# Altium schematic sheet PowerFilters.SchDoc
size A; SheetNumber: 14; SheetTotal: 14
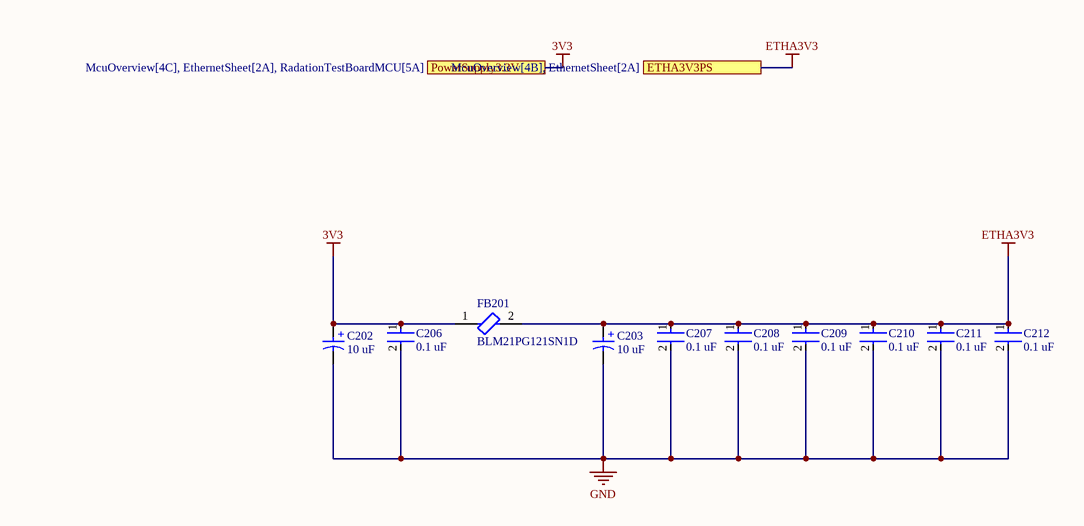
[diagram p0: PowerFilters.SchDoc]

## Parts
C202  10 uF  [WCAP-HTG5_D6.3H8]
C203  10 uF  [WCAP-HTG5_D6.3H8]
C206  0.1 uF  [FP-CC0603-DA-IPC_A]
C207  0.1 uF  [FP-CC0603-DA-IPC_A]
C208  0.1 uF  [FP-CC0603-DA-IPC_A]
C209  0.1 uF  [FP-CC0603-DA-IPC_A]
C210  0.1 uF  [FP-CC0603-DA-IPC_A]
C211  0.1 uF  [FP-CC0603-DA-IPC_A]
C212  0.1 uF  [FP-CC0603-DA-IPC_A]
FB201  BLM21PG121SN1D  [FP-BLM21-0_2-t0_85-e0_5-d-IPC_C]

## Ports
ETHA3V3PS (see McuOverview[4B], EthernetSheet[2A]), PowerSupply3.3V (see McuOverview[4C], EthernetSheet[2A], RadationTestBoardMCU[5A])

## Nets
3V3: C202.1(P) C206.1 FB201.1 ; port PowerSupply3.3V
ETHA3V3: C203.1(P) C207.1 C208.1 C209.1 C210.1 C211.1 C212.1 FB201.2 ; port ETHA3V3PS
GND: C202.2(N) C203.2(N) C206.2 C207.2 C208.2 C209.2 C210.2 C211.2 C212.2

## Notes on the sheet
- (in symbol CMP-03913-134709123-1) +

## Library data of the parts
C202 C203 = CMP-03913-134709123-1: 870575873001 Cap, 10Uf, 63V, Alu Elec, Hybrid, Rad Rohs Compliant: Yes 870575873001; Capacitance: 10µF; Pitch: 2.5mm; Hole Diameter: 900µm; ESR (Equivalent Series Resistance): 100mΩ; Leakage Current: 6.3µA; Ripple Current: 1.06A; NexarPartId: 134709123; Diameter: 6.3mm; Length: 8mm; Voltage Rating: 63V; Max Operating Temperature: 105°C; Min Operating Temperature: -55°C; RoHS: Compliant
C206-C212 = CMP-03422-001490-1: CAP CER 0.1UF 50V X7R 0603 CC0603JRX7R9BB104; Capacitance: 100nF; Tolerance: 5%; Number of Pins: 2; Depth: 0.8mm; Weight: 7.1E-05oz; Radiation Hardening: No; Case Code (Metric): 1608; Dielectric: X7R; Max Operating Temperature: 125°C; Voltage Rating (DC): 50V; Case/Package: 0603; Halogen Free: Halogen Free; Mount: Surface Mount; Lead Free: Lead Free; Termination: SMD/SMT; RoHS Compliant: Yes; Length: 1.6mm; Series: CC; Resistor Type: Ceramic; Case Code (Imperial): 0603; Construction: Flat; Width: 0.031inch; Height: 0.8mm; Voltage Rating: 50V; Min Operating Temperature: -55°C; Thickness: 0.035inch; Packaging: Tape and Reel
FB201 = CMP-0686-00612-3: Chip Ferrite Bead, 0805, 120Ω @ 100MHz, 0.03Ω, 25%, 3A; Impedance: 120R; Number of Circuits: 1; Material: Steel; DC Resistance (DCR): 30mR; Package Quantity: 1; Lead Free: Lead Free; Width: 1.25mm; Number of Pins: 2; Depth: 1.25mm; Case Code (Imperial): 0805; Tolerance: 25%; Current Rating: 3A; Test Frequency: 100MHz; Length: 2mm; Min Operating Temperature: -55°C; Max Current Rating: 3A; REACH SVHC: No SVHC; Series: BLM21P; Height: 0.85mm; Max DC Current: 3A; Termination: SMD/SMT; Max Operating Temperature: 125°C; Number of Lines: 1; Case/Package: 0805; RoHS Compliant: Yes; Packaging: Tape and Reel; Case Code (Metric): 2012; DC Resistance-Max: 30mR